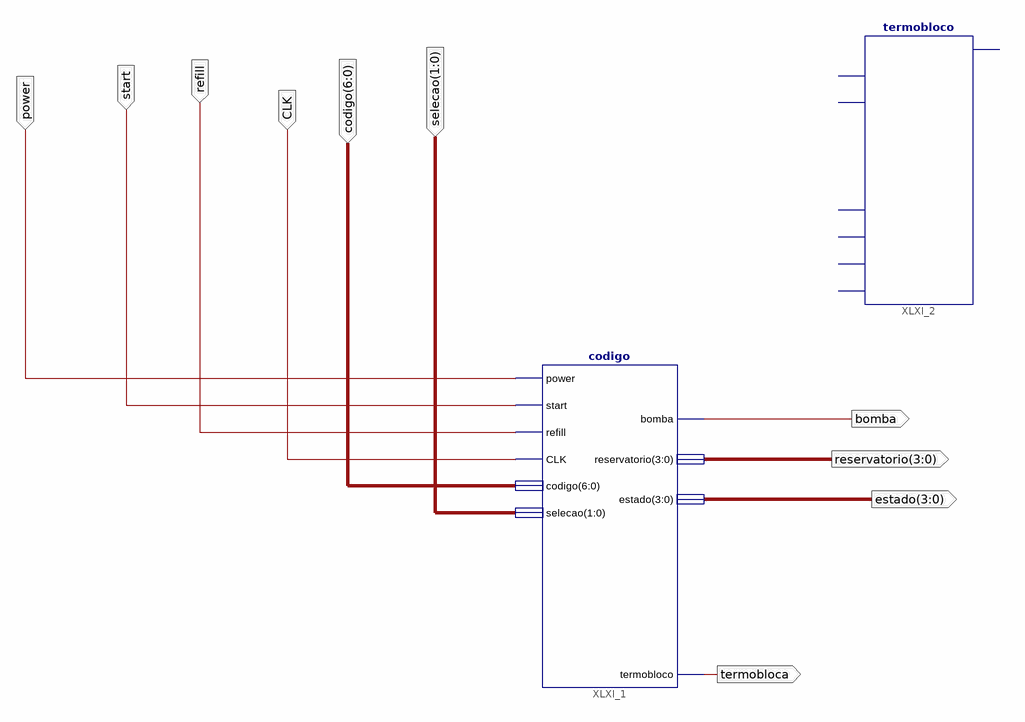
[diagram p0: schematic sheet 1]
// Xilinx ISE schematic circuito_eletrico.sch (spartan6) as structural Verilog: 2 symbols, 10 ports
module circuito_eletrico (
  input  refill,
  input  CLK,
  input  start,
  input  power,
  input  [6:0] codigo,
  input  [1:0] selecao,
  output [3:0] estado,
  output [3:0] reservatorio,
  output bomba,
  output termobloca
);

  codigo XLXI_1 (
    .power(power), .start(start), .refill(refill), .CLK(CLK), .codigo(codigo), .selecao(selecao),
    .bomba(bomba), .reservatorio(reservatorio), .estado(estado), .termobloco(termobloca));
  termobloco XLXI_2 ();  // open: segundos, estado2, estado3, estado1, contador_ligar, estado0, termobloco
endmodule
